# EAGLE design open_bioband_VB.2 (EAGLE 8.0.0)
COMPANY: ADAFRUIT INDUSTRIES; DRAWN: KTOWN; REV: B
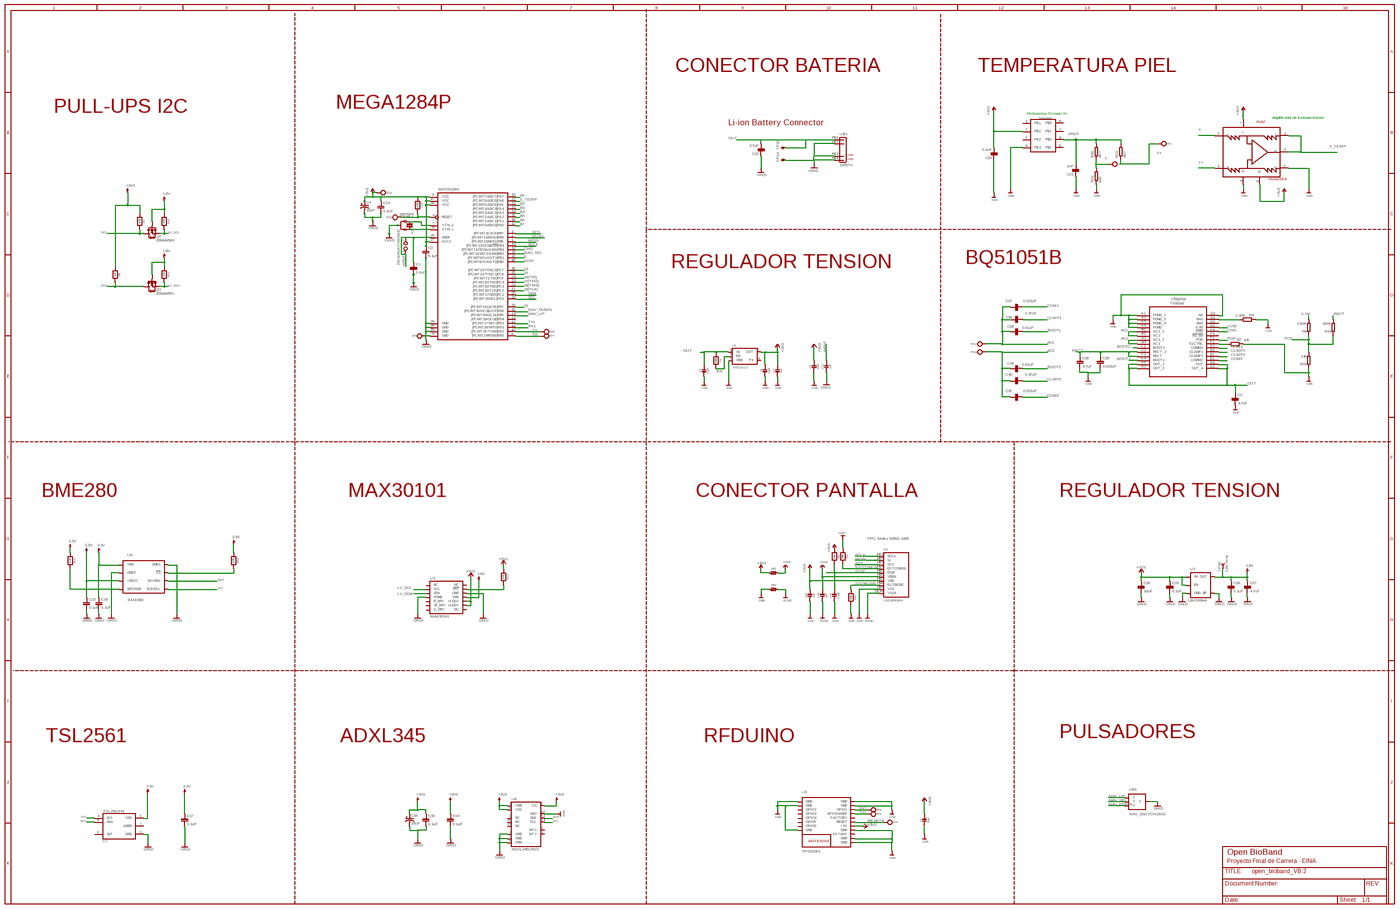
[diagram p0: schematic, sheet 1, overview]
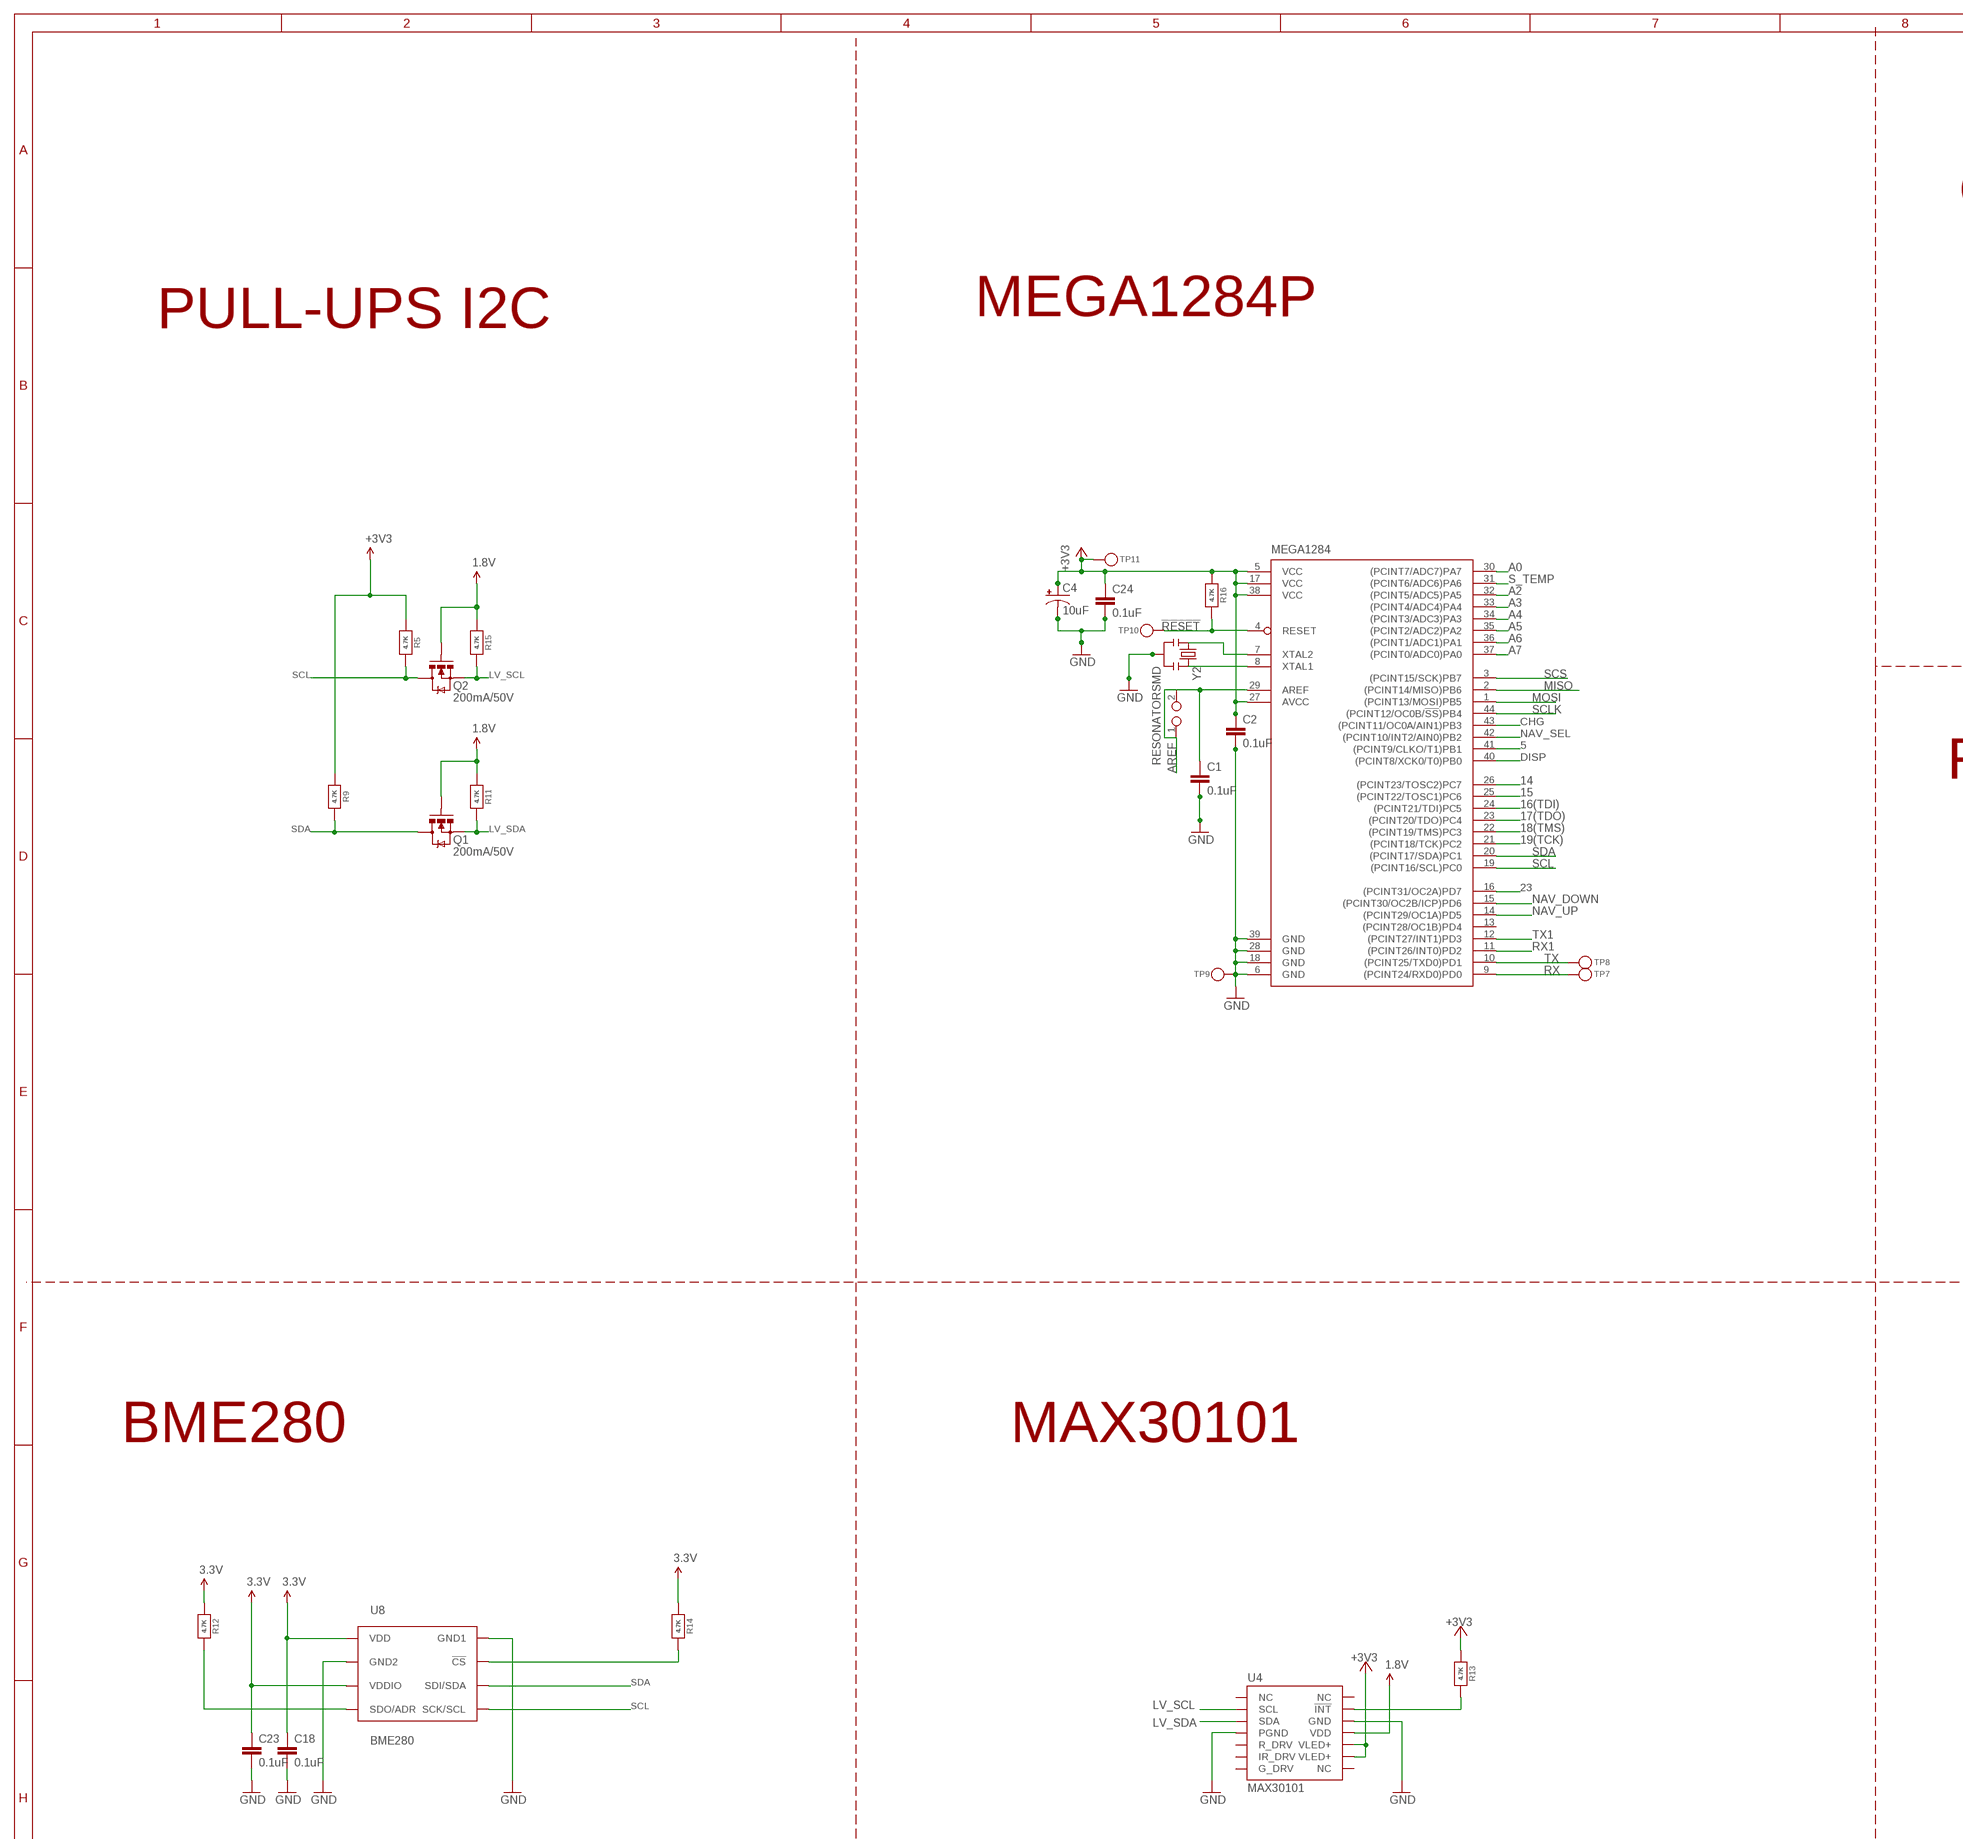
[diagram p1: schematic, sheet 1, part 1 of 4]
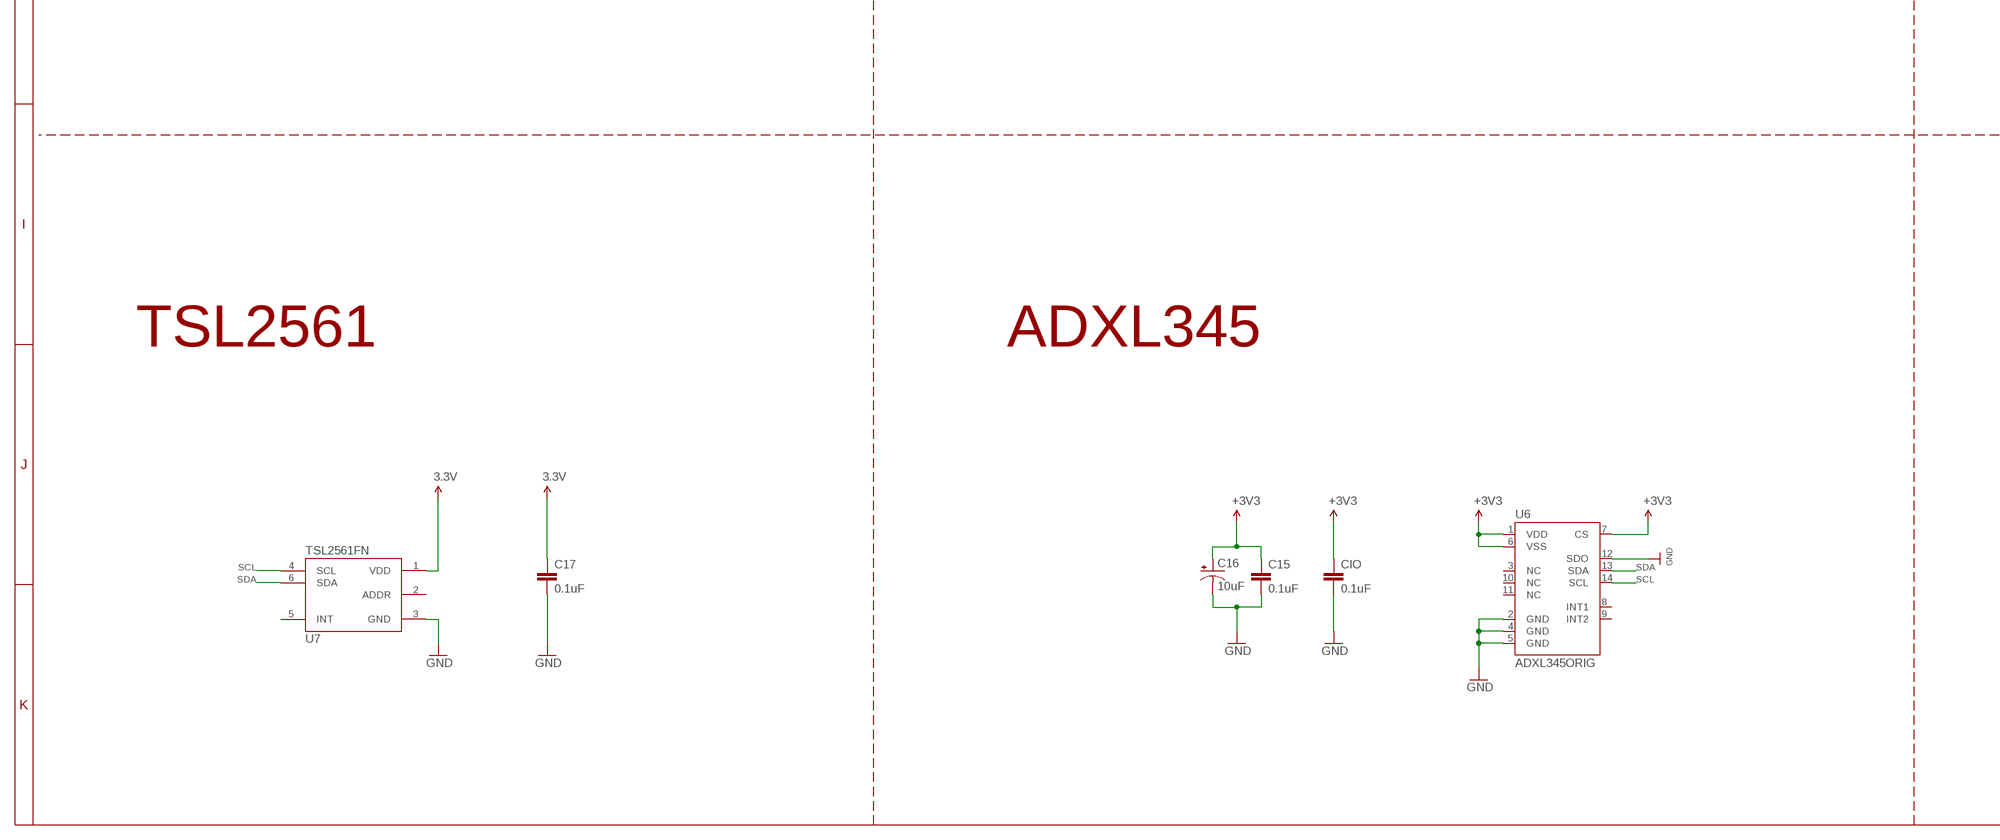
[diagram p2: schematic, sheet 1, part 2 of 4]
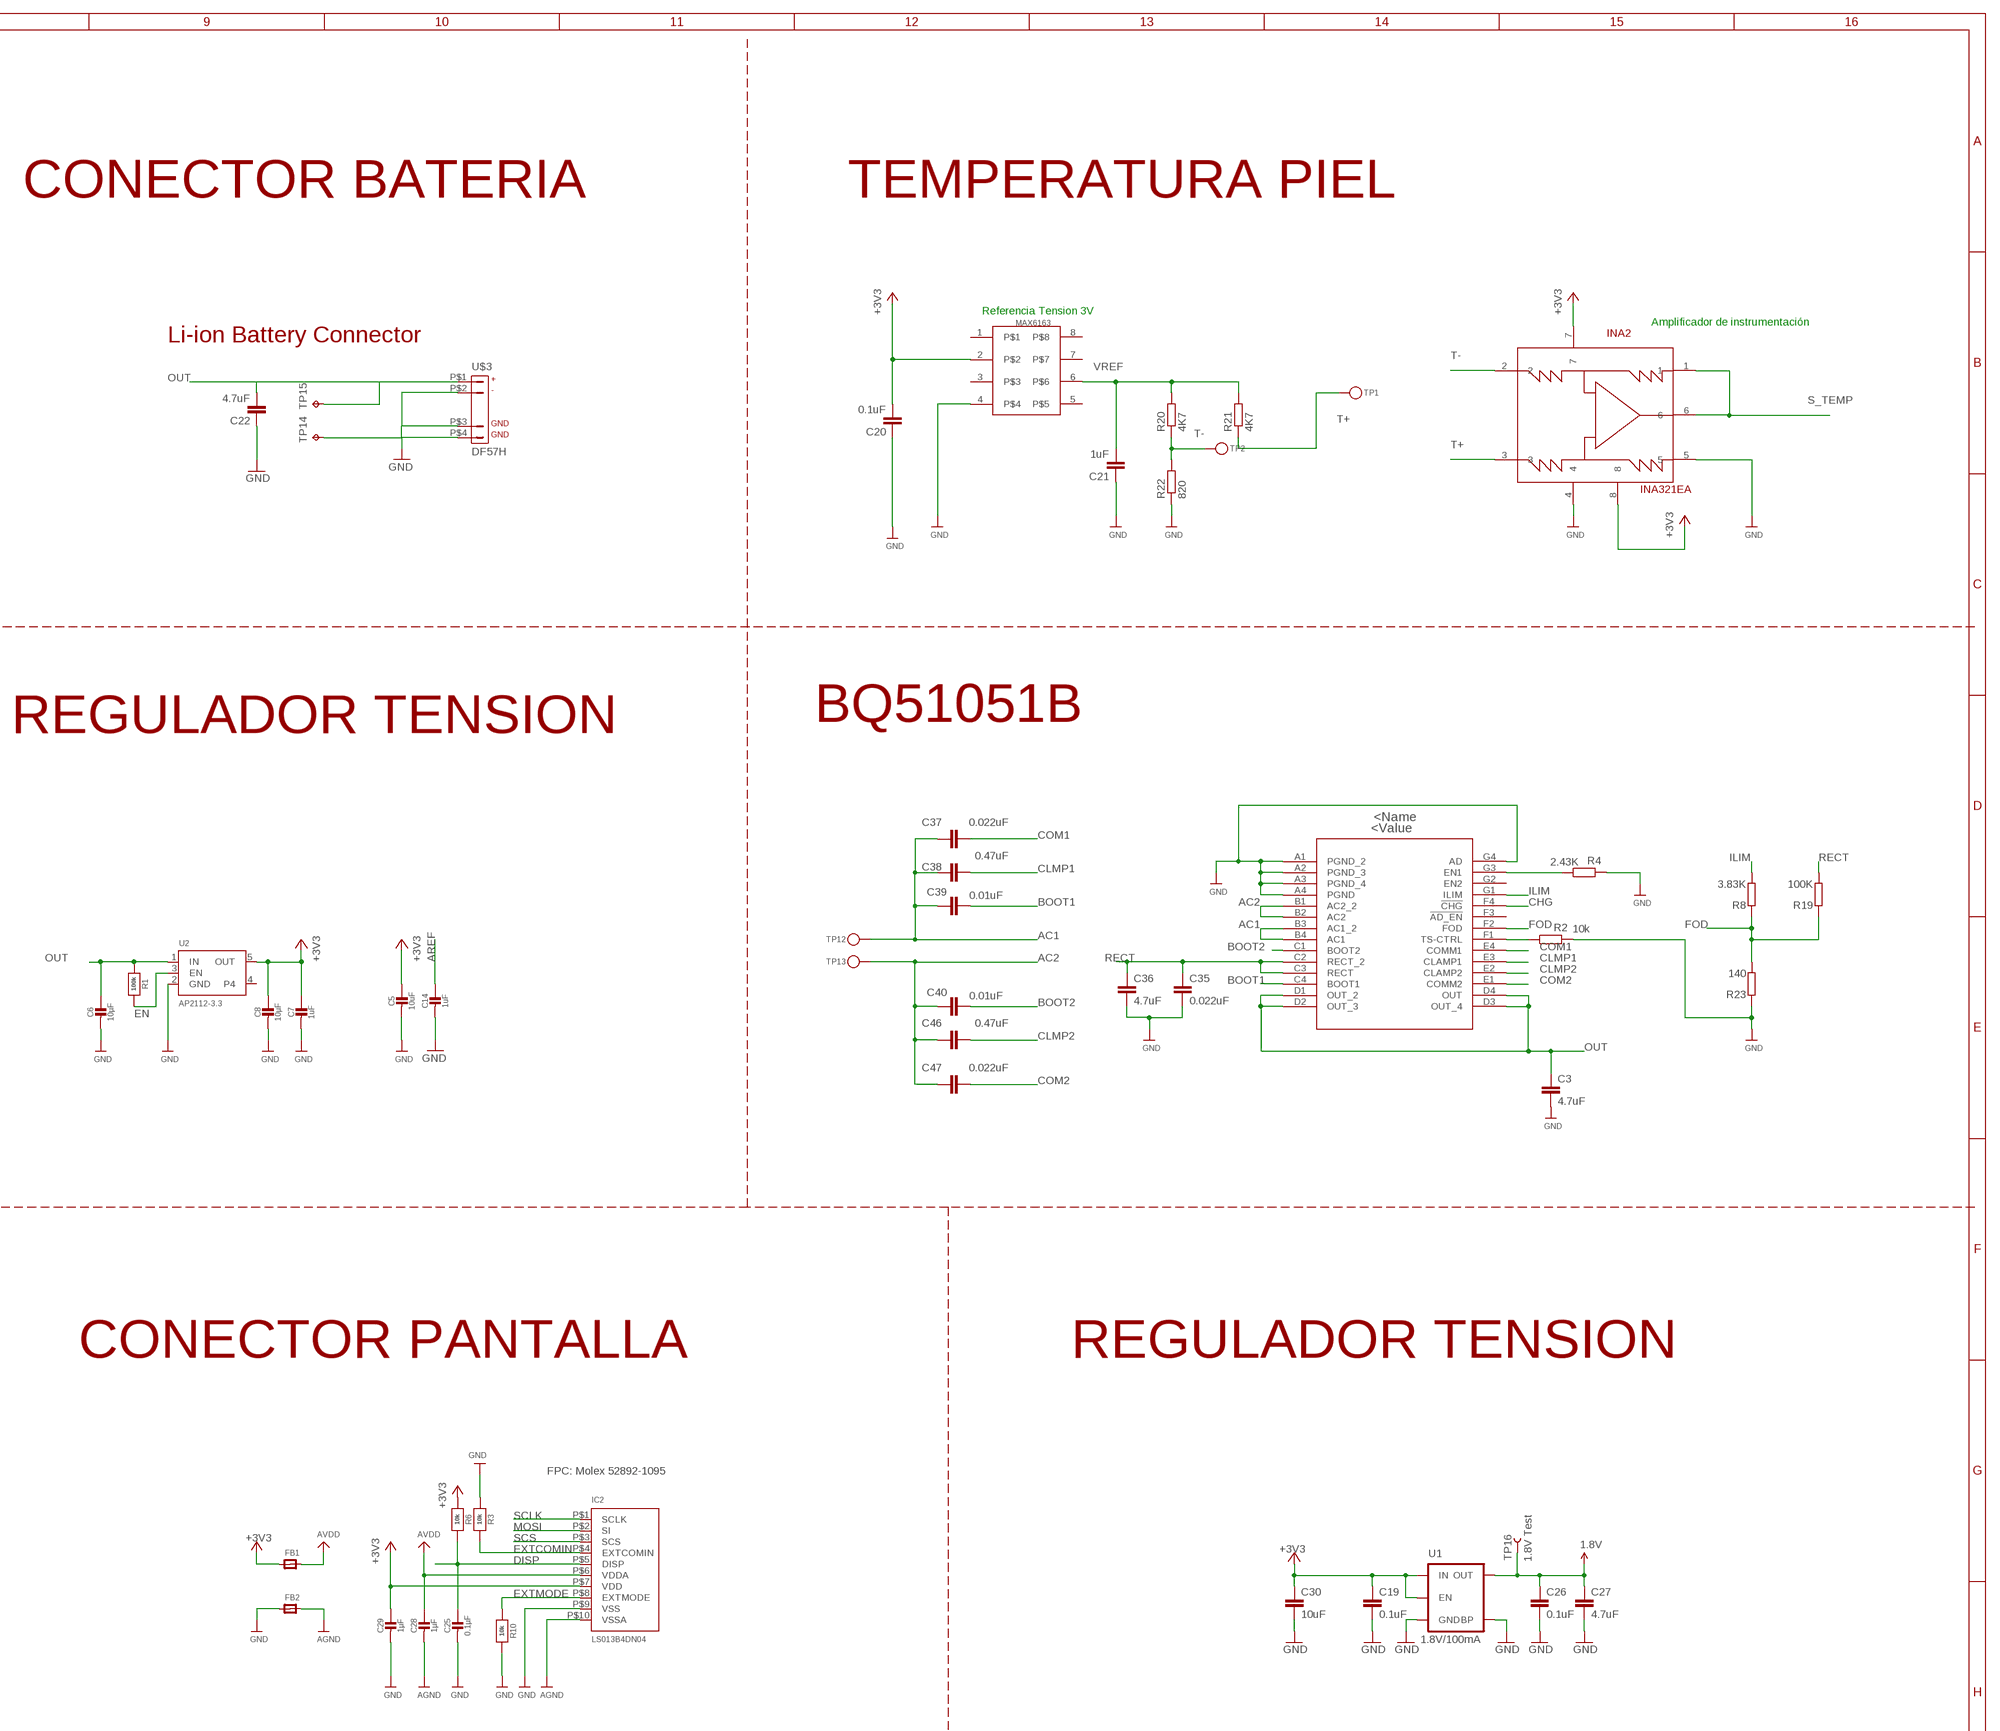
[diagram p3: schematic, sheet 1, part 3 of 4]
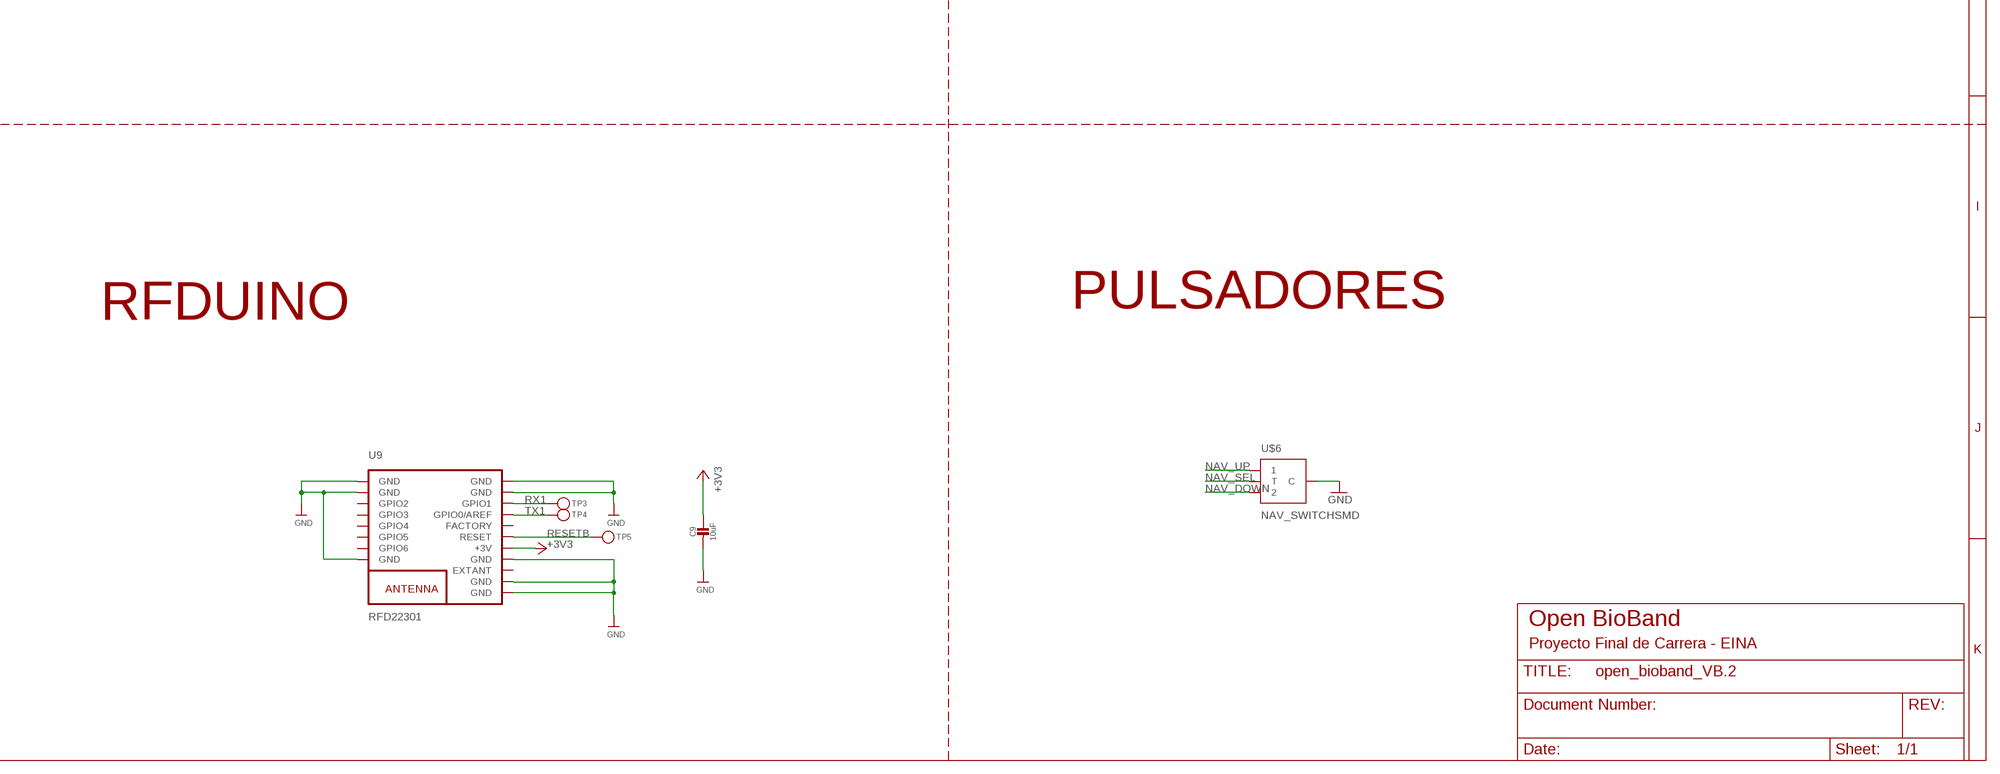
[diagram p4: schematic, sheet 1, part 4 of 4]

## Parts
C1  0.1uF  CAP0402-CAP  [0402-CAP]
C2  0.1uF  CAP0402-CAP  [0402-CAP]
C3  4.7uF  C-EUC0402  [C0402]
C4  10uF  CAP_POL1206  [EIA3216]
C5  10uF  CAP_CERAMIC_0402  [_0402]
C6  10µF  CAP_CERAMIC_0402  [_0402]
C7  1uF  CAP_CERAMIC_0402  [_0402]
C8  10µF  CAP_CERAMIC_0402  [_0402]
C9  10uF  CAP_CERAMIC_0402  [_0402]
C14  1uF  CAP_CERAMIC_0402  [_0402]
C15  0.1uF  CAP0402-CAP  [0402-CAP]
C16  10uF  CAP_POL1206  [EIA3216]
C17  0.1uF  CAP0402-CAP  [0402-CAP]
C18  0.1uF  CAP0402-CAP  [0402-CAP]
C19  0.1uF  CAP0402-CAP  [0402-CAP]
C20  0.1uF  C-EUC0402  [C0402]
C21  1uF  C-EUC0402  [C0402]
C22  4.7uF  C-EUC0402  [C0402]
C23  0.1uF  CAP0402-CAP  [0402-CAP]
C24  0.1uF  CAP0402-CAP  [0402-CAP]
C25  0.1µF  CAP_CERAMIC_0402  [_0402]
C26  0.1uF  CAP0402-CAP  [0402-CAP]
C27  4.7uF  CAP0402-CAP  [0402-CAP]
C28  1µF  CAP_CERAMIC_0402  [_0402]
C29  1µF  CAP_CERAMIC_0402  [_0402]
C30  10uF  CAP0402-CAP  [0402-CAP]
C35  0.022uF  C-EUC0402  [C0402]
C36  4.7uF  C-EUC0402  [C0402]
C37  0.022uF  C-EUC0402  [C0402]
C38  0.47uF  C-EUC0402  [C0402]
C39  0.01uF  C-EUC0402  [C0402]
C40  0.01uF  C-EUC0402  [C0402]
C46  0.47uF  C-EUC0402  [C0402]
C47  0.022uF  C-EUC0402  [C0402]
CIO  0.1uF  CAP0402-CAP  [0402-CAP]
FB1  FERRITE_0402  [_0402]
FB2  FERRITE_0402  [_0402]
IC2  LS013B4DN04  SHARP_MEMORYLCD_10PIN  [FPC_10PIN_52892-1095]
INA2  INA321EA  [MSOP08]
MAX1  MAX6163  [SO08]
MEGA1284  ATMEGA644A  [TQFP44]
Q1  200mA/50V  MOSFET-NCHANNELBSS138  [SOT23-3]
Q2  200mA/50V  MOSFET-NCHANNELBSS138  [SOT23-3]
R1  100k  RESISTOR_0402  [_0402]
R2  10k  R-EU_R0402  [R0402]
R3  10k  RESISTOR_0402  [_0402]
R4  2.43K  R-EU_R0402  [R0402]
R5  4.7K  RESISTOR_0402  [_0402]
R6  10k  RESISTOR_0402  [_0402]
R8  3.83K  R-EU_R0402  [R0402]
R9  4.7K  RESISTOR_0402  [_0402]
R10  10k  RESISTOR_0402  [_0402]
R11  4.7K  RESISTOR_0402  [_0402]
R12  4.7K  RESISTOR_0402  [_0402]
R13  4.7K  RESISTOR_0402  [_0402]
R14  4.7K  RESISTOR_0402  [_0402]
R15  4.7K  RESISTOR_0402  [_0402]
R16  4.7K  RESISTOR_0402  [_0402]
R19  100K  R-EU_R0402  [R0402]
R20  4K7  R-EU_R0402  [R0402]
R21  4K7  R-EU_R0402  [R0402]
R22  820  R-EU_R0402  [R0402]
R23  140  R-EU_R0402  [R0402]
TP1  TESTPOINTROUND1.5MM  [TESTPOINT_ROUND_1.5MM]
TP2  TESTPOINTROUND1.5MM  [TESTPOINT_ROUND_1.5MM]
TP3  TESTPOINTROUND1.5MM  [TESTPOINT_ROUND_1.5MM]
TP4  TESTPOINTROUND1.5MM  [TESTPOINT_ROUND_1.5MM]
TP5  TESTPOINTROUND1.5MM  [TESTPOINT_ROUND_1.5MM]
TP7  TESTPOINTROUND1.5MM  [TESTPOINT_ROUND_1.5MM]
TP8  TESTPOINTROUND1.5MM  [TESTPOINT_ROUND_1.5MM]
TP9  TESTPOINTROUND1.5MM  [TESTPOINT_ROUND_1.5MM]
TP10  TESTPOINTROUND1.5MM  [TESTPOINT_ROUND_1.5MM]
TP11  TESTPOINTROUND1.5MM  [TESTPOINT_ROUND_1.5MM]
TP12  TESTPOINTROUND1.5MM  [TESTPOINT_ROUND_1.5MM]
TP13  TESTPOINTROUND1.5MM  [TESTPOINT_ROUND_1.5MM]
TP14  TPB1,27  [B1,27]
TP15  TPB1,27  [B1,27]
TP16  1.8V Test  TEST-POINT3X4  [PAD.03X.04]
U1  1.8V/100mA  V_REG_SP62141.8V  [SC70]
U2  AP2112-3.3  VREG_SOT23-5  [SOT23-5]
U3  BQ51003YFPT  [YFP28]
U4  MAX30101  MAX30105SMD  [OLGA-14]
U6  ADXL345ORIG  [LGA14]
U7  TSL2561FN  [FN-6]
U8  BME280  [BME280_LGA]
U9  RFD22301  [RFD22301]
U$3  DF57H  [DF57H-2P]
U$5  JUMPER1-1  [JUMPER1-1]
U$6  NAV_SWITCHSMD  [NAV_SWITCH]
Y2  RESONATORSMD  [RESONATOR-SMD]

## Nets
1.8V: C26.1 C27.1 Q1.1(G) Q2.1(G) R11.1 R15.1 TP16.P$1 U1.5(OUT) U4.11(VDD)
5: MEGA1284.41((PCINT9/CLKO/T1)PB1)
14: MEGA1284.26((PCINT23/TOSC2)PC7)
15: MEGA1284.25((PCINT22/TOSC1)PC6)
16(TDI): MEGA1284.24((PCINT21/TDI)PC5)
17(TDO): MEGA1284.23((PCINT20/TDO)PC4)
18(TMS): MEGA1284.22((PCINT19/TMS)PC3)
19(TCK): MEGA1284.21((PCINT18/TCK)PC2)
23: MEGA1284.16((PCINT31/OC2A)PD7)
!CS: R14.2 U8.P$2(!CS)
!INT: R13.2 U4.13(!INT)
!RESET: MEGA1284.4(RESET) R16.2 TP10.P$1
+3V3: C2.1 C4.A(+) C5.1 C7.1 C8.1 C9.1 C15.1 C16.A(+) C17.1 C19.1 C20.2 C24.1 C29.1 C30.1 CIO.1 FB1.1 IC2.P$7(VDD) INA2.7 INA2.8 MAX1.2 MEGA1284.5(VCC) MEGA1284.17(VCC) MEGA1284.27(AVCC) MEGA1284.38(VCC) R5.1 R6.1 R9.1 R13.1 R16.1 TP11.P$1 U1.1(IN) U1.3(EN) U2.5(OUT) U4.9(VLED+) U4.10(VLED+) U6.1(VDD) U6.6(VSS) U6.7(CS) U7.1(VDD) U9.13(+3V) ; supply symbol labelled 3.3V
A0: MEGA1284.30((PCINT7/ADC7)PA7)
A2: MEGA1284.32((PCINT5/ADC5)PA5)
A3: MEGA1284.33((PCINT4/ADC4)PA4)
A4: MEGA1284.34((PCINT3/ADC3)PA3)
A5: MEGA1284.35((PCINT2/ADC2)PA2)
A6: MEGA1284.36((PCINT1/ADC1)PA1)
A7: MEGA1284.37((PCINT0/ADC0)PA0)
AC1: C37.1 C38.1 C39.1 TP12.P$1 U3.B3(AC1_2) U3.B4(AC1)
AC2: C40.1 C46.1 C47.1 TP13.P$1 U3.B1(AC2_2) U3.B2(AC2)
AGND: C28.2 FB2.2 IC2.P$10(VSSA)
AREF: C1.1 C14.1 MEGA1284.29(AREF) U$5.1 U$5.2
AVDD: C28.1 FB1.2 IC2.P$6(VDDA)
BOOT1: C39.2 U3.C4(BOOT1)
BOOT2: C40.2 U3.C1(BOOT2)
CHG: MEGA1284.43((PCINT11/OC0A/AIN1)PB3) U3.F4(!CHG)
CLMP1: C38.2 U3.E3(CLAMP1)
CLMP2: C46.2 U3.E2(CLAMP2)
COM1: C37.2 U3.E4(COMM1)
COM2: C47.2 U3.E1(COMM2)
DISP: C25.1 IC2.P$5(DISP) MEGA1284.40((PCINT8/XCK0/T0)PB0) R6.2
EN: R1.2 U2.3(EN)
EXTCOMIN: IC2.P$4(EXTCOMIN) R3.2
EXTMODE: IC2.P$8(EXTMODE) R10.1
FOD: R8.1 R19.1 R23.2 U3.F2(FOD)
GND: C1.2 C2.2 C3.2 C4.C(-) C5.2 C6.2 C7.2 C8.2 C9.2 C14.2 C15.2 C16.C(-) C17.2 C18.2 C19.2 C20.1 C21.1 C22.1 C23.2 C24.2 C25.2 C26.2 C27.2 C29.2 C30.2 C35.2 C36.2 CIO.2 FB2.1 IC2.P$9(VSS) INA2.4 INA2.5 MAX1.4 MEGA1284.6(GND) MEGA1284.18(GND) MEGA1284.28(GND) MEGA1284.39(GND) R2.2 R3.1 R4.2 R10.2 R22.1 R23.1 TP9.P$1 TP14.TP U1.2(GND) U1.4(BP) U2.2(GND) U3.A1(PGND_2) U3.A2(PGND_3) U3.A3(PGND_4) U3.A4(PGND) U3.G4(AD) U4.4(PGND) U4.12(GND) U6.2(GND) U6.4(GND) U6.5(GND) U6.12(SDO) U7.3(GND) U8.P$1(GND1) U8.P$7(GND2) U9.1(GND) U9.2(GND) U9.8(GND) U9.9(GND) U9.10(GND) U9.12(GND) U9.18(GND) U9.19(GND) U$3.P$2 U$3.P$3 U$3.P$4 U$6.C Y2.2
ILIM: R8.2 U3.G1(ILIM)
LV_SCL: Q2.2(S) R15.2 U4.2(SCL)
LV_SDA: Q1.2(S) R11.2 U4.3(SDA)
MISO: MEGA1284.2((PCINT14/MISO)PB6)
MOSI: IC2.P$2(SI) MEGA1284.1((PCINT13/MOSI)PB5)
N$2: MEGA1284.7(XTAL2) Y2.1
N$3: R4.1 U3.G3(EN1)
N$9: MEGA1284.8(XTAL1) Y2.3
N$22: U3.C3(RECT)
N$32: R2.1 U3.F1(TS-CTRL)
NAV_DOWN: MEGA1284.15((PCINT30/OC2B/ICP)PD6) U$6.2
NAV_SEL: MEGA1284.42((PCINT10/INT2/AIN0)PB2) U$6.T
NAV_UP: MEGA1284.14((PCINT29/OC1A)PD5) U$6.1
OUT: C3.1 C6.1 C22.2 R1.1 TP15.TP U2.1(IN) U3.D1(OUT_2) U3.D2(OUT_3) U3.D3(OUT_4) U3.D4(OUT) U$3.P$1
RECT: C35.1 C36.1 R19.2 U3.C2(RECT_2)
RESETB: TP5.P$1 U9.14(RESET)
RX: MEGA1284.9((PCINT24/RXD0)PD0) TP7.P$1
RX1: MEGA1284.11((PCINT26/INT0)PD2) TP3.P$1 U9.17(GPIO1)
S_TEMP: INA2.1 INA2.6 MEGA1284.31((PCINT6/ADC6)PA6)
SCL: MEGA1284.19((PCINT16/SCL)PC0) Q2.3(D) R5.2 U6.14(SCL) U7.4(SCL) U8.P$4(SCK/SCL)
SCLK: IC2.P$1(SCLK) MEGA1284.44((PCINT12/OC0B/!SS!)PB4)
SCS: IC2.P$3(SCS) MEGA1284.3((PCINT15/SCK)PB7)
SDA: MEGA1284.20((PCINT17/SDA)PC1) Q1.3(D) R9.2 U6.13(SDA) U7.6(SDA) U8.P$3(SDI/SDA)
SDO/ADR: R12.2 U8.P$5(SDO/ADR)
T+: INA2.3 R21.1 TP1.P$1
T-: INA2.2 R20.1 R22.2 TP2.P$1
TX: MEGA1284.10((PCINT25/TXD0)PD1) TP8.P$1
TX1: MEGA1284.12((PCINT27/INT1)PD3) TP4.P$1 U9.16(GPIO0/AREF)
VCC: C18.1 C23.1 R12.1 R14.1 U8.P$6(VDDIO) U8.P$8(VDD) ; supply symbol labelled 3.3V
VREF: C21.2 MAX1.6 R20.2 R21.2
Unconnected: MAX1.1 MAX1.3 MAX1.5 MAX1.7 MAX1.8 MEGA1284.13((PCINT28/OC1B)PD4) U2.4 U3.F3(!AD_EN) U3.G2(EN2) U4.1(NC) U4.5(R_DRV) U4.6(IR_DRV) U4.7(G_DRV) U4.8(NC) U4.14(NC) U6.3(NC) U6.8(INT1) U6.9(INT2) U6.10(NC) U6.11(NC) U7.2(ADDR) U7.5(INT) U9.3(GPIO2) U9.4(GPIO3) U9.5(GPIO4) U9.6(GPIO5) U9.7(GPIO6) U9.11(EXTANT) U9.15(FACTORY)

## Notes on the sheet
- CONECTOR BATERIA | TEMPERATURA PIEL
- PULL-UPS I2C | MEGA1284P
- Referencia Tension 3V
- Li-ion Battery Connector | Amplificador de instrumentación
- REGULADOR TENSION | BQ51051B
- BME280 | MAX30101 | CONECTOR PANTALLA | REGULADOR TENSION
- FPC: Molex 52892-1095
- TSL2561 | ADXL345 | RFDUINO | PULSADORES
- Open BioBand
- Proyecto Final de Carrera - EINA

## Library data of the parts
C1 C2 C18 C23 C24 = microduino:CAP: Capacitor Standard 0603 ceramic capacitor, and 0.1" leaded capacitor.
C3 C22 C35-C40 C46 C47 = rcl:C-EU: CAPACITOR, European symbol
C4 = microduino:CAP_POL: Capacitor Polarized These are standard SMD and PTH capacitors. Normally 10uF, 47uF, and 100uF in electrolytic and tantalum varieties. Always verify the external diameter of the through hole cap, it varies with capacity, voltage, and manufacturer. The EIA devices should be standard.
C5-C9 C14 C25 C28 C29 = microbuilder:CAP_CERAMIC: Ceramic Capacitors For new designs, use the packages preceded by an '_' character since they are more reliable: The following footprints should be used on most boards: _0402 - Standard footprint for regular board layouts _0603 - Standard footprint for regular board layouts _0805 - Standard footprint for regular board layouts _1206 - Standard footprint for regular board layouts For extremely tight-pitch boards where space is at a premium, the following 'micro-pitch' footprints can be used (smaller pads, no silkscreen outline, etc.): _0402MP - Micro-pitch footprint for very dense/compact boards _0603MP - Micro-pitch footprint for very dense/compact boards _0805MP - Micro-pitch footprint for very dense/compact boards _1206MP - Micro-pitch footprint for very dense/compact boards
C15 CIO = SparkFun:CAP: Capacitor Standard 0603 ceramic capacitor, and 0.1" leaded capacitor.
C16 = SparkFun:CAP_POL: Capacitor Polarized These are standard SMD and PTH capacitors. Normally 10uF, 47uF, and 100uF in electrolytic and tantalum varieties. Always verify the external diameter of the through hole cap, it varies with capacity, voltage, and manufacturer. The EIA devices should be standard.
C17 C19 C26 C27 C30 = SparkFun-Capacitors:CAP: Capacitor Standard 0603 ceramic capacitor, and 0.1" leaded capacitor.
C20 C21 = resistor:C-EU: CAPACITOR, European symbol; OC_FARNELL: unknown
FB1 FB2 = microbuilder:FERRITE: Ferrite Bead 0603 MMZ1608B121C - 120 Ohm @ 100MHz, 600mA, 0.15 Ohm DC Resistance - Digikey: 445-2164-1-ND BK1608HW121-T - 120 Ohm, 600mA Ferrite Chip - Digikey: 587-1876-2-ND 0805 HZ0805B272R-10 - 2.7K Ohm @ 100MHz, 200mA, 0.8 Ohm DC Resistance - Digikey: 240-2504-1-ND (see also Murata BLM21BD272SN1L) MMZ2012Y152B - 1.5K Ohm @ 100MHz, 500mA, 0.4 Ohm DC Resistance - Digikey: 445-1560-1-ND - Mainly for high frequency (80-400MHz) MMZ2012R102A - 1K Ohm @ 100MHz, 500mA, 0.3 Ohm DC Resistance - Digikey: 445-1555-2-ND - More general purpose (10-200MHz)
IC2 = microbuilder:SHARP_MEMORYLCD_10PIN: Sharp Mono Memory LCD LS013B4DN02 - 1.35" 96x96 Pixels LS027B7DH01 - 2.7" 400x240 Pixels
INA2 = burr-brown:INA321EA: * AMP INSTRUMENTATION, VSSOP8, 321 * No. of Amplifiers:3 * Max Gain:1000 * Bandwidth:500kHz * No. of Pins:8 * Operating Temperature Range:-55°C to +125°C * SVHC:No SVHC * Case Style:VSSOP * Amplifier IC Type:Instrumentation * Base Number:321 * Gain Bandwidth:500kHz * IC Generic Number:321 * Input Offset Drift, Max:7µV/°C * Max Input Offset Voltage:1mV * Max Operating Temperature:125°C * Max Programmable Gain:1000 * Max Supply Voltage:5.5V * Min Supply Voltage:2.5V * Min Temperature Operating:-55°C * Output Type:Single Ended * Slew Rate:0.4V/µs * Supply Voltage + Nom:5.5V * Termination Type:SMD; OC_FARNELL: unknown
MAX1 = maxim_yuri:MAX6163: Referencia de tension de precision de 3V; OC_FARNELL: unknown
MEGA1284 = atmel:ATMEGA644: 8-bit Microcontroller with 64K Bytes In-System Programmable Flash Source: http://www.atmel.com/dyn/resources/prod_documents/doc2593.pdf; OC_FARNELL: 1455123; OC_NEWARK: 58M3748
Q1 Q2 = SparkFun-DiscreteSemi:MOSFET-NCHANNEL: Common NMOSFET Parts MFG P/N Store ID Prod ID FDD8780 TRANS-09984 SI7820DN TRANS-11055 FDS6630A IC-08089 2N7002PW TRANS-11151 FQP30N06L COM-10213 TRANS-10060 BSS123LT1G TRANS-08345 BSS138 TRANS-00830 BS170 2N7000; PROD_ID: TRANS-00830
R1 R3 R5 R6 R9-R16 = microbuilder:RESISTOR: Resistors For new designs, use the packages preceded by an '_' character since they are more reliable: The following footprints should be used on most boards: _0402 - Standard footprint for regular board layouts _0603 - Standard footprint for regular board layouts _0805 - Standard footprint for regular board layouts _1206 - Standard footprint for regular board layouts For extremely tight-pitch boards where space is at a premium, the following 'micro-pitch' footprints can be used (smaller pads, no silkscreen outline, etc.): _0402MP - Micro-pitch footprint for very dense/compact boards _0603MP - Micro-pitch footprint for very dense/compact boards _0805MP - Micro-pitch footprint for very dense/compact boards _1206MP - Micro-pitch footprint for very dense/compact boards
R2 R4 R8 R19 R23 = rcl:R-EU_: RESISTOR, European symbol
R20-R22 = resistor:R-EU_: RESISTOR, European symbol; OC_FARNELL: unknown
TP1-TP5 TP7-TP13 = microbuilder:TESTPOINT: Test Point Various test points for characterisation and PCB testing TESTPOINT_SMT - Compact Surface Mount Test Point [Digikey: 5016KTR-ND]
TP14 TP15 = testpad:TP: Test pad
TP16 = SparkFun-Passives:TEST-POINT: Bare copper test points for troubleshooting or ICT
U1 = SparkFun-PowerIC:V_REG_SP6214; PROD_ID: VREG-08428
U2 = microbuilder:VREG_SOT23-5: SOT23-5 Fixed Voltage Regulators Part Current Out V Out V In V Dropout θJA (°C/W) TJ (°C) Digikey Part No. ADP121 150mA 3.3V 3.4-5.5V 0.09V @ 150mA -- -- ADP121-AUJZ33R7CT-ND ADP121 150mA 3.0V 3.1-5.5V 0.09V @ 150mA -- -- ADP121-AUJZ30R7CT-ND ADP122 300mA 3.3V 3.4-5.5V 0.085V @ 300mA -- -- ADP122AUJZ-3.3-R7CT-ND ADP1712 300mA 3.3V 3.5-5.5V 0.17V @ 300mA -- -- ADP1712AUJZ-3.3-R7TR-ND AP7311 (Low Cost) 150mA 3.3V 3.5-6V 0.15V @ 150mA -- -- AP7311-33WG-7DICT-ND LD39015M18R 150mA 1.8V 1.9V-5.5V 0.08V @ 100mA -- -- 497-6977-1-ND LP2985A-33DBVR 150mA 3.3V 3.3-16V 0.28V @ 150mA 206 150 296-18479-1-ND MCP1824T-3302E/OT 300mA 3.3V 3.5V-6V 0.2V @ 300mA -- -- MCP1824T-3302E/OTCT-ND MIC5205-2.5YM5 TR 150mA 2.5V 2.7-16V 0.165V @ 150mA -- -- 576-1257-2-ND MIC5205-3.0YM5 TR 150mA 3.0V 3.2V-16V 0.165V @ 150mA -- -- 576-1258-2-ND MIC5205-3.3YM5 TR 150mA 3.3V 3.5V-16V 0.165V @ 150mA -- -- 576-1259-2-ND TPS780330220 150mA 3.3V+2.2V 3.6-5.5V 250mV Max -- -- 296-23332-1-ND TDA3663/N1,135 100mA 3.3V 3.5-45V 0.18V @ 50mA -- -- 568-5343-1-ND Max operating temp can be calculated using θJA, TJ (max junction temperature), and power in watts. Set the "Maximum Ambient Temperature" until it reaches TJ ("Max Junction Temperature"), which is the absolute limit for safe use of the regulator: Heat Sink Temperature Calculator <http://www.daycounter.com/Calculators/Heat-Sink-Temperature-Calculator.phtml> For example, With 12V source into a 3.3V LP2985 and a 30mA load, we are dissipating (12V-3.3V) * 0.03A = 0.261W. With a θJA of 206 °C/W, a TJ of 150°C, and 261mW we can safely use the chip without a heat sink up to 75°C (=147.1°C Junction Temperature).
U3 = BQ51003:BQ51003YFPT; COPYRIGHT: Copyright C 2016 Accelerated Designs. All rights reserved; MANUFACTURER_PART_NUMBER: bq51003yfpt; VENDOR: Texas Instruments
U4 = SparkFun-Sensors:MAX30105: Description: Particle Detection IC. Primarily used for smoke detection, can be used for Pulse Detection, Pulse Ox, and possible visual particle detection.; PROD_ID: IC-13510; VALUE: MAX30105
U6 = Testing:ADXL345
U7 = mike-temp:TSL2561: TSL2561 illumination sensor Approximates Human Eye Response Precisely Measures Illuminance Programmable Interrupt Function with User-Defined Upper and Lower Threshold 400 KHz I2C interface Programmable Analog Gain and Integration Time Supporting 1,000,000-to-1 Dynamic Range Automatically Rejects 50/60-Hz Lighting Ripple Low Active Power (0.75 mW Typical) with Power Down Mode RoHS Compliant The TSL2561 is a light-to-digital converter that transform light intensity to a digital signal output via I2C interface. The device combines one broadband photodiode (visible plus infrared) and one infrared-responding photodiode on a single CMOS integrated circuit capable of providing a near-photopic response over an effective 20-bit dynamic range (16-bit resolution). Two integrating ADCs convert the photodiode currents to a digital output that represents the irradiance measured on each channel. This digital output can be input to a microprocessor where illuminance (ambient light level) in lux is derived using an empirical formula to approximate the human eye response. The TSL2561 device supports a traditional level style interrupt that remains asserted until the firmware clears it.
U8 = BME280ComponentLibrary:BME280; PROD_ID: IC-13090
U9 = RF_Digital_RFD22301_Eagle_Schematic_PCB_Library:RFD22301: RFD22301 RFduino SMT Module RFD22301 Datasheet: http://www.rfdigital.com/wp-content/uploads/2014/03/RFD22301.Data_.Sheet_.11.24.13_11.38PM.pdf
U$3 = onomo:DF57H
U$5 = microduino:JUMPER1-1
U$6 = SparkFun-Electromechanical:NAV_SWITCH: Navigation Switch Three way navigation switch. Commonly used as up/down/select on MP3 players. Schematic element and footprint production proven. Spark Fun Electronics SKU : COM-08184
Y2 = microduino:RESONATOR: Resonator Small SMD resonator. This is the itty bitty 10/20MHz resonators with built in caps. CSTCE10M0G55 and CSTCE20M0V53. Footprint has been reviewed closely but hasn't been tested yet.

## Net classes
1 power: width 0.203 mm

## Board
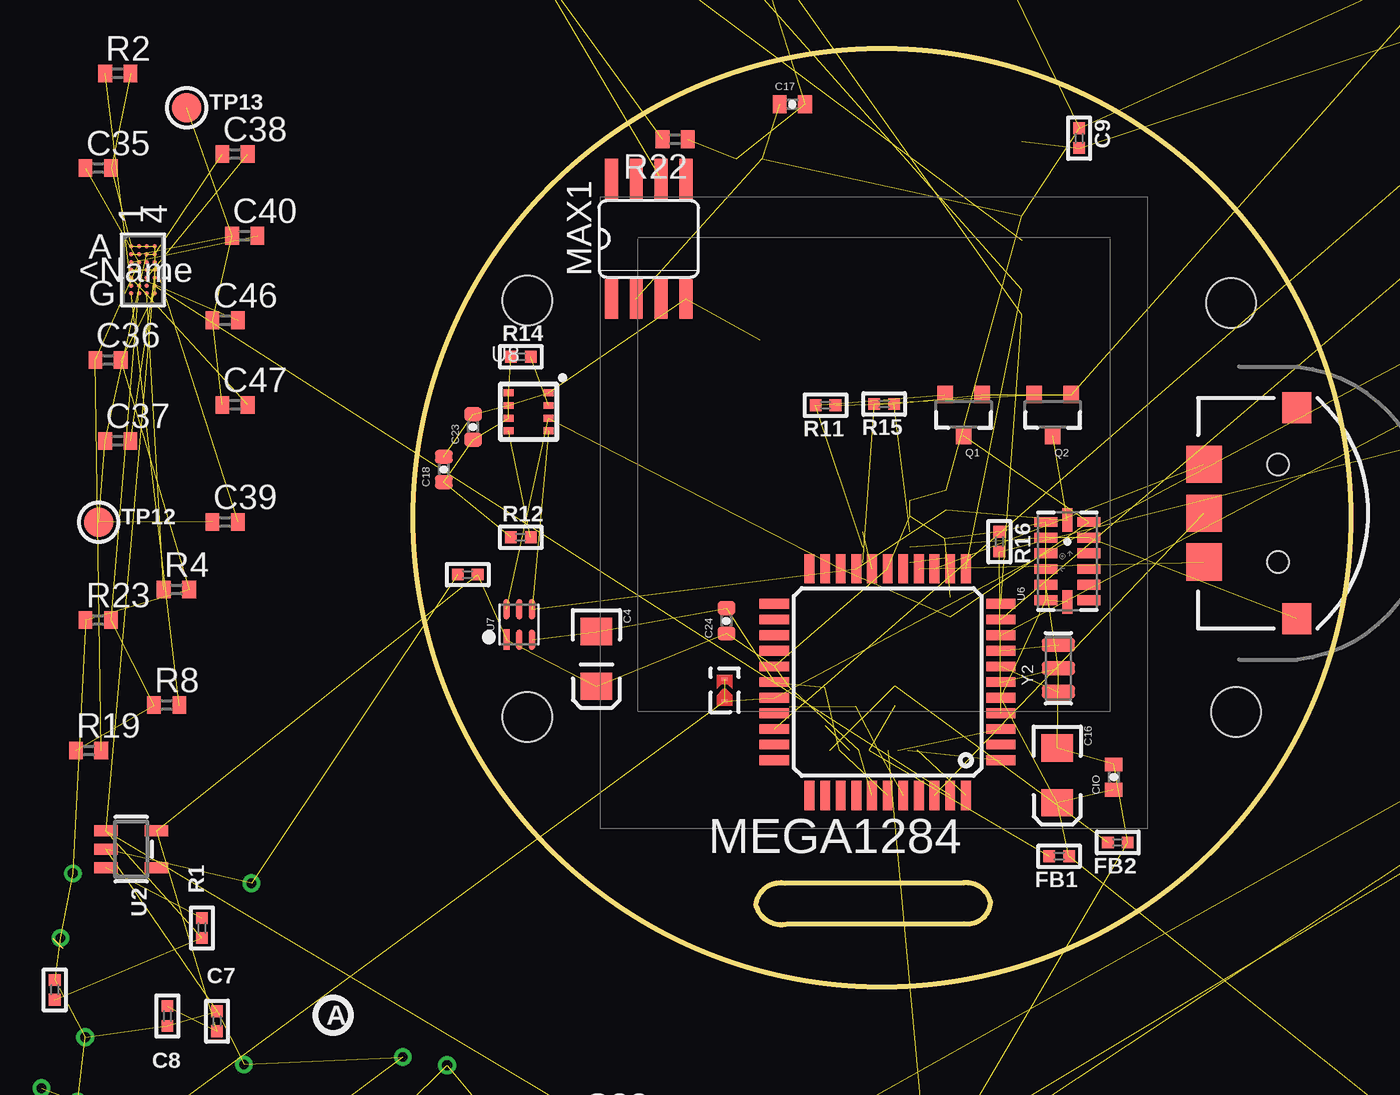
[diagram p5: board, top side]
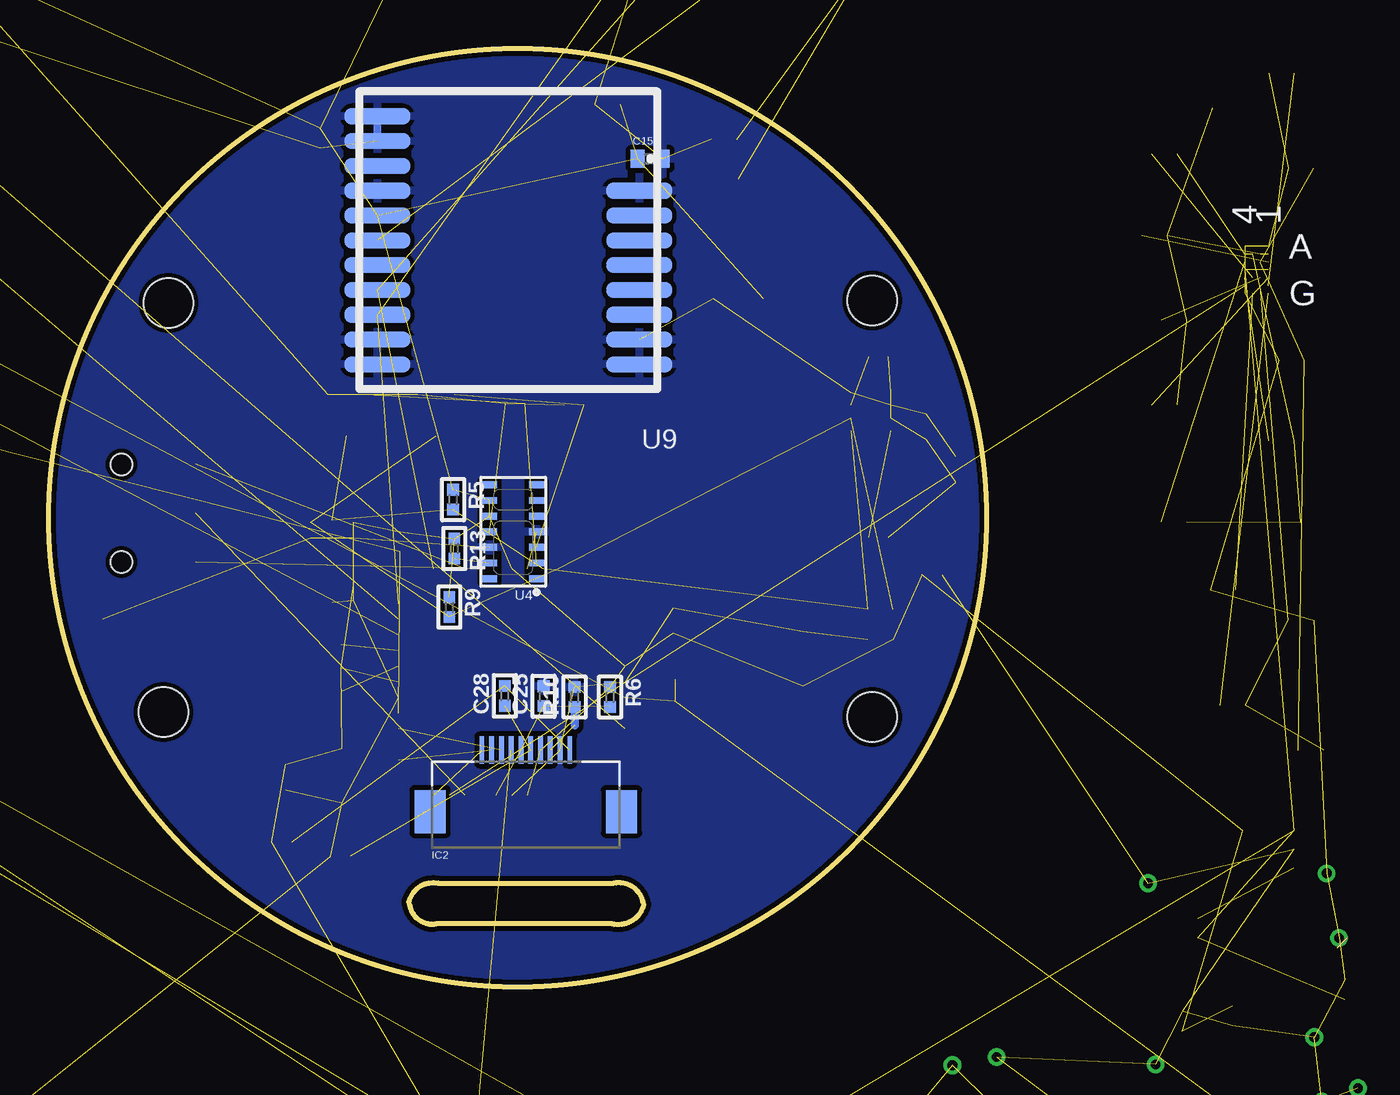
[diagram p6: board, bottom side, seen from below]

Size 66.43 x 48 mm. Coordinates in mm from the lower left corner, seen from the top.
Outline: 0,2.48 0.51,1.97
Outline: 36.01,4.31 arc-90 37.51,5.3 46.51,5.3 arc-90 48.01,4.31
Outline: 47.97,4.21 arc-90 46.6,3.22 37.6,3.22 arc-90 35.97,4.21
Outline: circle at 42.43,24 radius 24
Copper layers (1*16): Top 0.035mm / dielectric 1.5mm / Bottom 0.035mm
Design rules "adafruit *": minimum track width 8mil, minimum drill 15.5mil, track to track 8mil, track to pad 8mil, pad to pad 8mil, via to via 8mil, smd to smd 8mil, copper to edge 10mil, drill to drill 8mil, minimum pad ring 10mil, minimum via ring 8mil, stop-mask expansion 2mil, vias tented up to drill 20mil, thermal gap 10mil
Holes 2.54 mm at 24.29,35.12 60.56,14.07 60.3,34.99 24.28,13.82

### Footprints (pad centres in the part's own frame; a part is rotated, then mirrored left to right if it is on the bottom)
0402-CAP = smd 0.7 x 0.9: 1 -0.65,0; 2 0.65,0
C0402 = smd 0.7 x 0.9: 1 -0.65,0; 2 0.65,0
EIA3216 = smd 1.4 x 1.6: A 1.4,0; C -1.4,0
_0402 = smd 0.6 x 0.6: 1 -0.508,0; 2 0.508,0
FPC_10PIN_52892-1095 = smd 0.25 x 1.4: P$1 -2.25,0; P$2 -1.75,0; P$3 -1.25,0; P$4 -0.75,0; P$5 -0.25,0; P$6 0.25,0; P$7 0.75,0; P$8 1.25,0; P$9 1.75,0; P$10 2.25,0 | smd 1.6 x 2.2: SUPPORT1 -4.9,-3.15; SUPPORT2 4.9,-3.15
MSOP08 = smd 0.3 x 1.2: 1 -0.976,-2.113; 2 -0.326,-2.113; 3 0.324,-2.113; 4 0.974,-2.113; 5 0.974,2.112; 6 0.324,2.112; 7 -0.326,2.112; 8 -0.976,2.112
SO08 = smd 0.66 x 2.032: 1 -1.905,-3.073; 2 -0.635,-3.073; 3 0.635,-3.073; 4 1.905,-3.073; 5 1.905,3.073; 6 0.635,3.073; 7 -0.635,3.073; 8 -1.905,3.073
TQFP44 = smd 1.5 x 0.5: 1 -5.8,4; 2 -5.8,3.2; 3 -5.8,2.4; 4 -5.8,1.6; 5 -5.8,0.8; 6 -5.8,0; 7 -5.8,-0.8; 8 -5.8,-1.6; 9 -5.8,-2.4; 10 -5.8,-3.2; 11 -5.8,-4; 23 5.8,-4; 24 5.8,-3.2; 25 5.8,-2.4; 26 5.8,-1.6; 27 5.8,-0.8; 28 5.8,0; 29 5.8,0.8; 30 5.8,1.6; 31 5.8,2.4; 32 5.8,3.2; 33 5.8,4 | smd 0.5 x 1.5: 12 -4,-5.8; 13 -3.2,-5.8; 14 -2.4,-5.8; 15 -1.6,-5.8; 16 -0.8,-5.8; 17 0,-5.8; 18 0.8,-5.8; 19 1.6,-5.8; 20 2.4,-5.8; 21 3.2,-5.8; 22 4,-5.8; 34 4,5.8; 35 3.2,5.8; 36 2.4,5.8; 37 1.6,5.8; 38 0.8,5.8; 39 0,5.8; 40 -0.8,5.8; 41 -1.6,5.8; 42 -2.4,5.8; 43 -3.2,5.8; 44 -4,5.8
SOT23-3 = smd 0.8 x 0.9: 1 -0.95,-1; 2 0.95,-1; 3 0,1.1
R0402 = smd 0.7 x 0.9: 1 -0.65,0; 2 0.65,0
TESTPOINT_ROUND_1.5MM = smd 1.5 x 1.5: P$1 0,0
B1,27 = smd 1.27 x 1.27: TP 0,0
PAD.03X.04 = smd 1.016 x 1.016: P$1 0,0
SC70 = smd 0.4 x 0.75: 1 -0.65,-0.825; 2 0,-0.825; 3 0.65,-0.825; 4 0.65,0.825; 5 -0.65,0.825
SOT23-5 = smd 0.55 x 1.2: 1 -0.95,-1.3; 2 0,-1.3; 3 0.95,-1.3; 4 0.95,1.3; 5 -0.95,1.3
YFP28 = smd 0.229 x 0.229: A1 -0.6,1.2; A2 -0.2,1.2; A3 0.2,1.2; A4 0.6,1.2; B1 -0.6,0.8; B2 -0.2,0.8; B3 0.2,0.8; B4 0.6,0.8; C1 -0.6,0.4; C2 -0.2,0.4; C3 0.2,0.4; C4 0.6,0.4; D1 -0.6,0; D2 -0.2,0; D3 0.2,0; D4 0.6,0; E1 -0.6,-0.4; E2 -0.2,-0.4; E3 0.2,-0.4; E4 0.6,-0.4; F1 -0.6,-0.8; F2 -0.2,-0.8; F3 0.2,-0.8; F4 0.6,-0.8; G1 -0.6,-1.2; G2 -0.2,-1.2; G3 0.2,-1.2; G4 0.6,-1.2
OLGA-14 = smd 0.75 x 0.35: 1 -1.2,2.4; 2 -1.2,1.6; 3 -1.2,0.8; 4 -1.2,0; 5 -1.2,-0.8; 6 -1.2,-1.6; 7 -1.2,-2.4; 8 1.2,-2.4; 9 1.2,-1.6; 10 1.2,-0.8; 11 1.2,0; 12 1.2,0.8; 13 1.2,1.6; 14 1.2,2.4
LGA14 = smd 0.5 x 1.2: 1 2,1.1; 2 1.2,1.1; 3 0.4,1.1; 4 -0.4,1.1; 5 -1.2,1.1; 6 -2,1.1; 8 -2,-1.1; 9 -1.2,-1.1; 10 -0.4,-1.1; 11 0.4,-1.1; 12 1.2,-1.1; 13 2,-1.1 | smd 1.2 x 0.5: 7 -2.1,0; 14 2.1,0
FN-6 = smd 1.05 x 0.3: 1 -0.775,0.65; 2 -0.775,0; 3 -0.775,-0.65; 4 0.775,-0.65; 5 0.775,0; 6 0.775,0.65
BME280_LGA = smd 0.5 x 0.35: P$1 1.025,0.975; P$2 1.025,0.325; P$3 1.025,-0.325; P$4 1.025,-0.975; P$5 -1.025,-0.975; P$6 -1.025,-0.325; P$7 -1.025,0.325; P$8 -1.025,0.975
RFD22301 = smd 3.353 x 0.813: 1 -6.706,7.62; 2 -6.706,6.35; 3 -6.706,5.08; 4 -6.706,3.81; 5 -6.706,2.54; 6 -6.706,1.27; 7 -6.706,0; 8 -6.706,-1.27; 9 6.706,-5.08; 10 6.706,-3.81; 11 6.706,-2.54; 12 6.706,-1.27; 13 6.706,0; 14 6.706,1.27; 15 6.706,2.54; 16 6.706,3.81; 17 6.706,5.08; 18 6.706,6.35; 19 6.706,7.62
DF57H-2P = smd 0.508 x 1.016: P$1 1.4,3.95; P$2 2.7,3.95 | smd 0.635 x 1.27: P$3 0.2,0.5; P$4 3.9,0.5
JUMPER1-1 = smd 0.152 x 0.305: 1 -0.562,0; 2 0.562,0
NAV_SWITCH = smd 1.9 x 1.8: 1 -2.5,-3.8; 2 2.5,-3.8; T 0,-3.8 | smd 1.6 x 1.5: C 5.4,0.95; NC -5.4,0.95 | hole 1.1: -2.5,0; 2.5,0
RESONATOR-SMD = smd 0.7 x 1.7: 1 -1.2,0; 2 0,0; 3 1.2,0

### Placement (x,y rotation side)
C1  78.85,36.8 0 top  (outside the outline)
C2  78.85,41.6 0 top  (outside the outline)
C3  76.35,50.22 0 top  (outside the outline)
C4  27.82,16.78 270 top
C5  21.23,21.09 180 top
C6  0.09,-0.16 90 top
C7  8.4,-1.77 90 top
C8  5.86,-1.49 270 top
C9  52.53,43.43 270 top
C14  2.72,-9.03 0 top  (outside the outline)
C15  35.65,42.37 0 bottom
C16  51.41,10.82 270 top
C17  37.85,45.17 0 top
C18  20,26.48 90 top
C19  87.54,49.81 0 top  (outside the outline)
C20  42.47,63.39 0 top  (outside the outline)
C21  33.08,64.39 0 top  (outside the outline)
C22  27.82,-7.36 0 top  (outside the outline)
C23  21.5,28.65 90 top
C24  34.48,18.73 90 top
C25  41.1,14.87 90 bottom
C26  84.6,45.12 0 top  (outside the outline)
C27  84.77,48.12 0 top  (outside the outline)
C28  43.09,14.89 90 bottom
C29  71.01,-8.91 180 top  (outside the outline)
C30  88.1,46.8 0 top  (outside the outline)
C35  2.32,41.9 0 top
C36  2.82,32.07 0 top
C37  3.32,27.94 0 top
C38  9.32,42.62 0 top
C39  8.82,23.79 0 top
C40  9.82,38.44 0 top
C46  8.82,34.11 0 top
C47  9.32,29.78 0 top
CIO  54.31,10.73 90 top
FB1  51.51,6.69 180 top
FB2  54.51,7.39 180 top
IC2  42.02,12.12 0 bottom
INA2  84.75,56.03 0 top  (outside the outline)
MAX1  30.5,38.28 0 top
MEGA1284  42.73,15.6 180 top
Q1  46.62,29.3 180 top
Q2  51.18,29.3 180 top
R1  7.62,3.01 90 top
R2  3.32,46.75 0 top
R3  44.45,-11.52 0 top  (outside the outline)
R4  6.32,20.33 0 top
R5  45.74,24.93 270 bottom
R6  37.71,14.83 270 bottom
R8  5.82,14.42 0 top
R9  45.93,19.43 270 bottom
R10  39.52,14.83 90 bottom
R11  39.55,29.76 180 top
R12  23.95,23 0 top
R13  45.67,22.43 270 bottom
R14  23.95,32.24 0 top
R15  42.55,29.83 180 top
R16  48.45,22.78 270 top
R19  1.82,12.09 0 top
R20  18.09,62.34 0 top  (outside the outline)
R21  59.32,62.39 0 top  (outside the outline)
R22  31.85,43.37 180 top
R23  2.32,18.77 0 top
TP1  51.34,60.71 0 top  (outside the outline)
TP2  49.84,64.42 0 top  (outside the outline)
TP3  27.84,65.13 0 top  (outside the outline)
TP4  26.84,61.35 0 top  (outside the outline)
TP5  26.34,55.56 0 top  (outside the outline)
TP7  88.84,39.28 0 top  (outside the outline)
TP8  79.84,45.49 0 top  (outside the outline)
TP9  83.34,40.2 0 top  (outside the outline)
TP10  90.34,32.92 0 top  (outside the outline)
TP11  87.34,36.13 0 top  (outside the outline)
TP12  2.34,23.78 0 top
TP13  6.84,44.99 0 top
TP14  23.96,-8.57 0 top  (outside the outline)
TP15  33.96,-10.13 0 top  (outside the outline)
TP16  77.4,58.67 0 top  (outside the outline)
U1  87.47,43.31 0 top  (outside the outline)
U2  4.01,7.04 270 top
U3  4.61,36.69 0 top
U4  42.66,23.29 180 bottom
U6  51.93,21.78 90 top
U7  23.86,18.54 90 top
U8  24.34,29.42 0 top
U9  42.91,39.47 180 bottom
U$3  91.94,19.2 0 top  (outside the outline)
U$5  34.38,15.16 90 top
U$6  62.73,24.24 270 top
U$25  [PCBFEAT-REV-040]  14.35,-1.45 0 top
Y2  51.47,16.3 90 top

### Tracks (layer width: path | path; a pad name or v marks a point on that pad's centre or on a via)
1.8V  (8 unrouted)
!CS  (1 unrouted)
!INT  (1 unrouted)
!RESET  (2 unrouted)
+3V3  (39 unrouted)
AC1  (5 unrouted)
AC2  (5 unrouted)
AGND  (2 unrouted)
AREF  (4 unrouted)
AVDD  (2 unrouted)
BOOT1  (1 unrouted)
BOOT2  (1 unrouted)
CHG  (1 unrouted)
CLMP1  (1 unrouted)
CLMP2  (1 unrouted)
COM1  (1 unrouted)
COM2  (1 unrouted)
DISP  (3 unrouted)
EN  (1 unrouted)
EXTCOMIN  (1 unrouted)
EXTMODE  (1 unrouted)
  Bottom 0.406: R10.1 39.52,13.38
FOD  (3 unrouted)
GND  (via drill 0.5)  (76 unrouted)
  Bottom 0.406: U9.10 U9.9
  other vias: -0.59,-5.19 1.65,-2.58 1.02,5.8 5.84,-7.79 1.27,-5.88 10.16,5.3 17.91,-3.59 9.78,-3.97 0.38,2.5 20.17,-4.01 37.21,-13.27 40.91,-12.31 12.87,-7.36 18.03,-6.15
  pour Top (isolate 0.254): 81,12.38 135,11.88 135,-37.12 79,-37.12
  pour Bottom (isolate 0.254): 18,50.38 68.5,49.88 69.5,-2.12 18,-1.62
ILIM  (1 unrouted)
LV_SCL  (2 unrouted)
LV_SDA  (2 unrouted)
MOSI  (1 unrouted)
N$2  (1 unrouted)
N$3  (1 unrouted)
N$9  (1 unrouted)
N$32  (1 unrouted)
NAV_DOWN  (1 unrouted)
NAV_SEL  (1 unrouted)
NAV_UP  (1 unrouted)
OUT  (10 unrouted)
RECT  (3 unrouted)
RESETB  (1 unrouted)
RX  (1 unrouted)
RX1  (2 unrouted)
S_TEMP  (2 unrouted)
SCL  (5 unrouted)
SCLK  (1 unrouted)
SCS  (1 unrouted)
SDA  (5 unrouted)
SDO/ADR  (1 unrouted)
T+  (2 unrouted)
T-  (3 unrouted)
TX  (1 unrouted)
TX1  (2 unrouted)
VCC  (5 unrouted)
VREF  (3 unrouted)